# EAGLE schematic fonte (EAGLE 9.6.2)
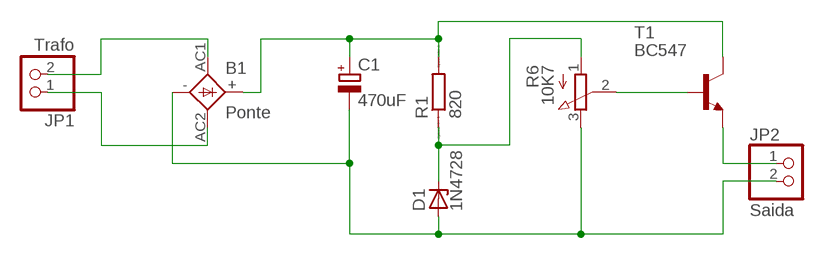
[diagram p0: schematic, sheet 1]

## Parts
B1  Ponte  1KAB  [1KAB]
C1  470uF  CPOL-EUE5-10.5  [E5-10,5]
D1  1N4728  [DO41Z10]
JP1  Trafo  PINHD-1X2  [1X02]
JP2  Saida  PINHD-1X2  [1X02]
R1  820  R0207/10  [0207/10]
R6  10K7  3RP/1610N  [3RP/1610N]
T1  BC547  [TO92]

## Nets
N$1: B1.AC1 JP1.2
N$2: B1.AC2 JP1.1
N$3: B1.+ C1.+ R1.2 T1.3(C)
N$6: JP2.1 T1.1(E)
N$7: D1.C R1.1 R6.1(A)
N$8: R6.2(S) T1.2(B)
N$12: B1.- C1.- D1.A JP2.2 R6.3(E)

## Library data of the parts
B1 = rectifier:1KAB: RECTIFIER grid 5,08 x 5,08 mm
C1 = resistor:CPOL-EU: POLARIZED CAPACITOR, European symbol
D1 = diode:1N4728: Z DIODE 3.3 V, 1W, 5 percent
JP1 JP2 = pinhead:PINHD-1X2: PIN HEADER
R1 = eagle-ltspice:R: RESISTOR, European symbol; SPICEMODEL: NONE; SPICEPREFIX: R
R6 = pot:3RP/1610N: 16mm Potentiometer one level Source: http://www.alphapotentiometers.net/html/16mm_pot_2.html
T1 = transistor:BC547: NPN TRANSISTOR